# EAGLE design volume_ctrl (EAGLE 7.5.0)
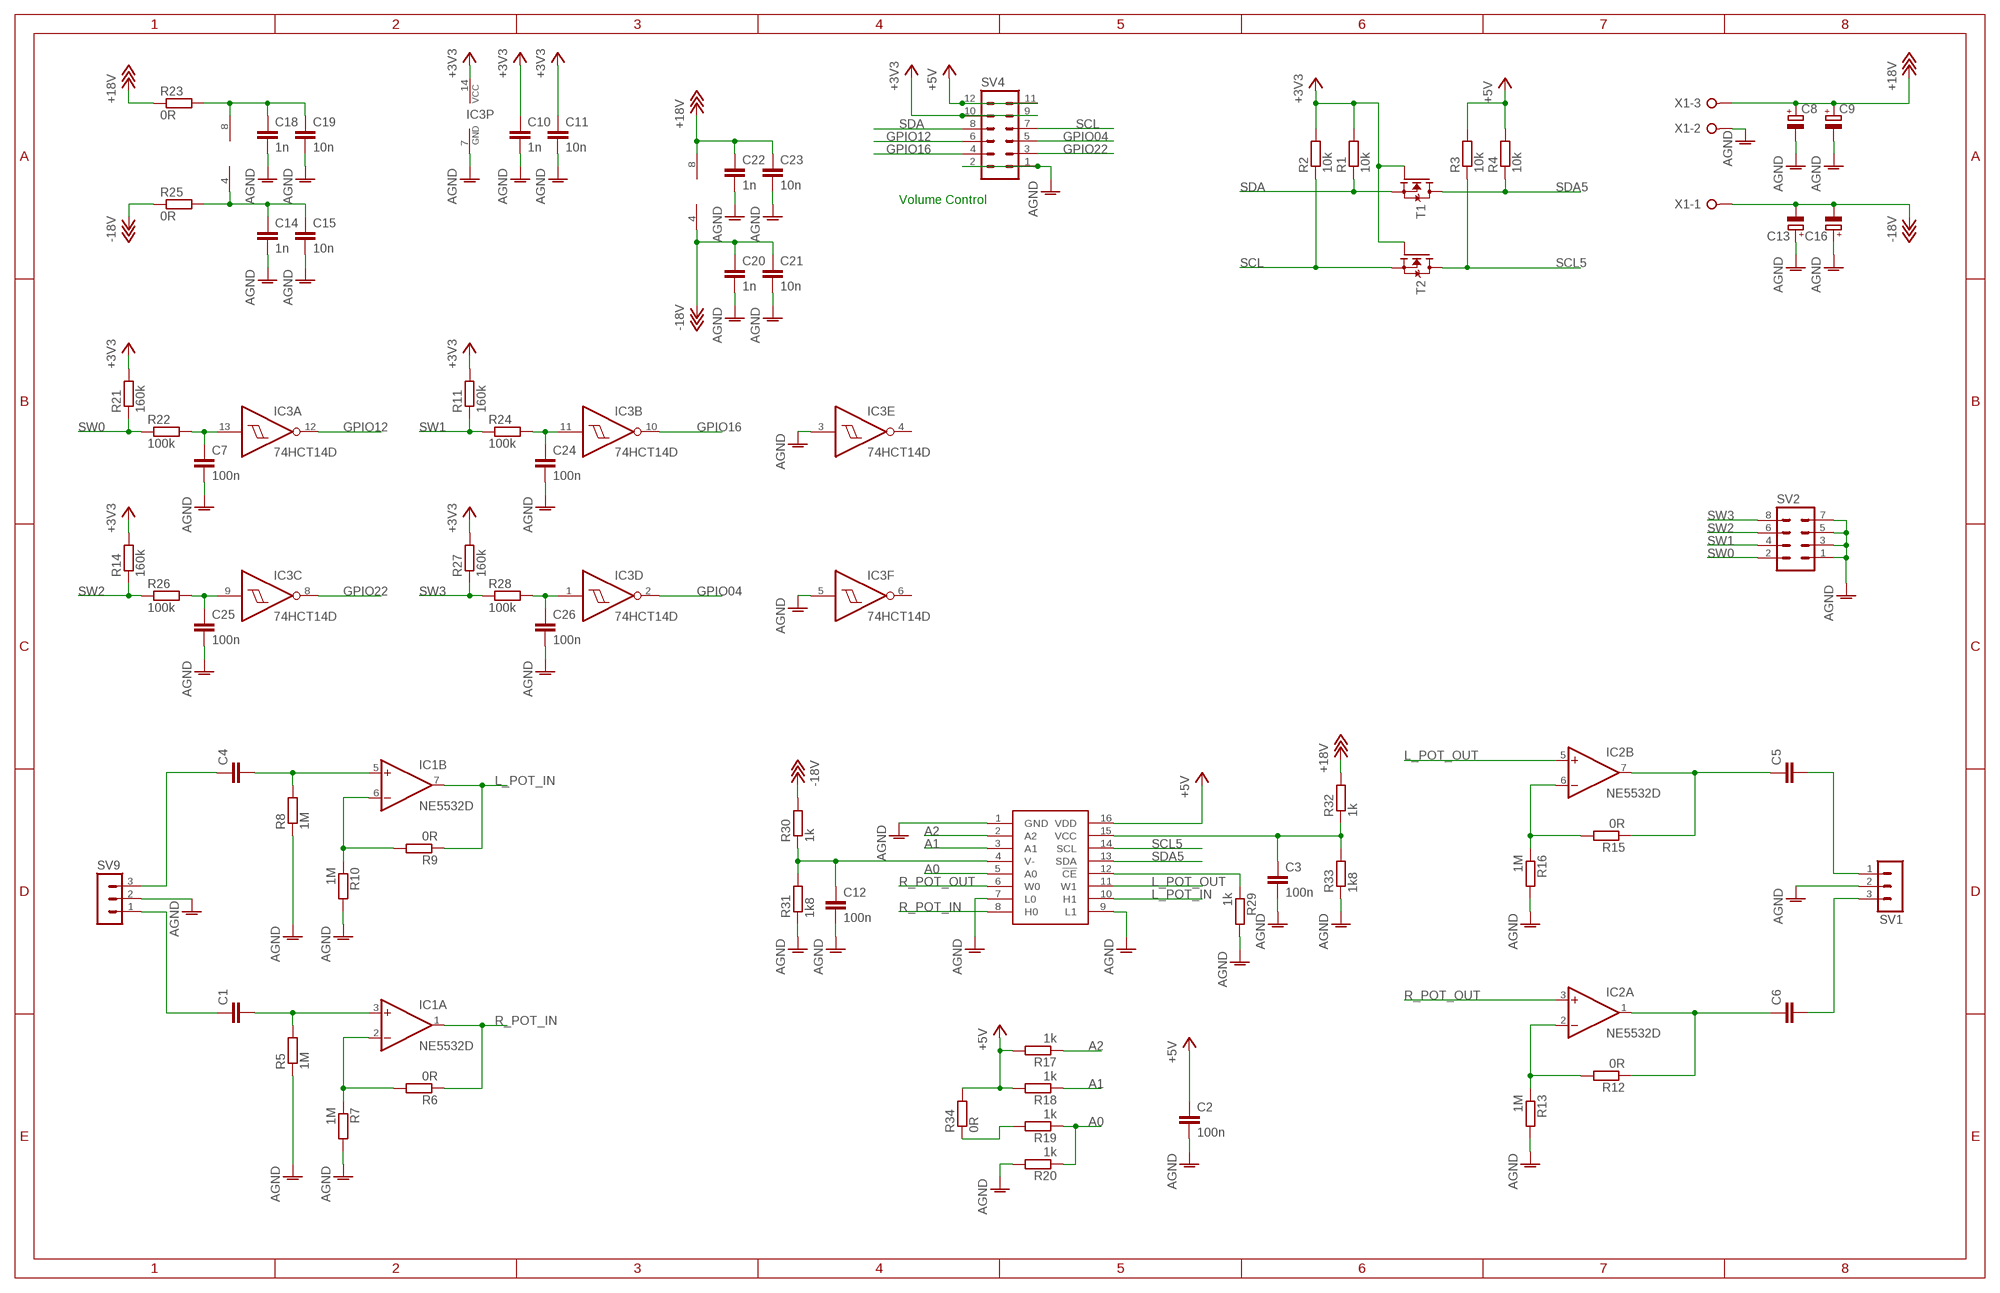
[diagram p0: schematic, sheet 1]

## Parts
C1  C22/7  [C22.5B7]
C2  100n  C-EUC0603  [C0603]
C3  100n  C-EUC0603  [C0603]
C4  C22/7  [C22.5B7]
C5  C22/7  [C22.5B7]
C6  C22/7  [C22.5B7]
C7  100n  C-EUC0603  [C0603]
C8  CPOL-EUE5-10.5  [E5-10,5]
C9  CPOL-EUE5-10.5  [E5-10,5]
C10  1n  C-EUC0603  [C0603]
C11  10n  C-EUC0603  [C0603]
C12  100n  C-EUC0603  [C0603]
C13  CPOL-EUE5-10.5  [E5-10,5]
C14  1n  C-EUC0603  [C0603]
C15  10n  C-EUC0603  [C0603]
C16  CPOL-EUE5-10.5  [E5-10,5]
C18  1n  C-EUC0603  [C0603]
C19  10n  C-EUC0603  [C0603]
C20  1n  C-EUC0603  [C0603]
C21  10n  C-EUC0603  [C0603]
C22  1n  C-EUC0603  [C0603]
C23  10n  C-EUC0603  [C0603]
C24  100n  C-EUC0603  [C0603]
C25  100n  C-EUC0603  [C0603]
C26  100n  C-EUC0603  [C0603]
IC1  NE5532D  [SO08]
IC2  NE5532D  [SO08]
IC3  74HCT14D  [SO14]
IC4  DS1882  [SO16]
R1  10k  R-EU_R0805  [R0805]
R2  10k  R-EU_R0805  [R0805]
R3  10k  R-EU_R0805  [R0805]
R4  10k  R-EU_R1206  [R1206]
R5  1M  R-EU_R0805  [R0805]
R6  0R  R-EU_R0805  [R0805]
R7  1M  R-EU_R0805  [R0805]
R8  1M  R-EU_R0805  [R0805]
R9  0R  R-EU_R0805  [R0805]
R10  1M  R-EU_R0805  [R0805]
R11  160k  R-EU_R1206  [R1206]
R12  0R  R-EU_R0805  [R0805]
R13  1M  R-EU_R0805  [R0805]
R14  160k  R-EU_R1206  [R1206]
R15  0R  R-EU_R0805  [R0805]
R16  1M  R-EU_R0805  [R0805]
R17  1k  R-EU_R0805  [R0805]
R18  1k  R-EU_R0805  [R0805]
R19  1k  R-EU_R0805  [R0805]
R20  1k  R-EU_R0805  [R0805]
R21  160k  R-EU_R0603  [R0603]
R22  100k  R-EU_R0603  [R0603]
R23  0R  R-EU_R1206  [R1206]
R24  100k  R-EU_R0603  [R0603]
R25  0R  R-EU_R1206  [R1206]
R26  100k  R-EU_R0603  [R0603]
R27  160k  R-EU_R0603  [R0603]
R28  100k  R-EU_R0603  [R0603]
R29  1k  R-EU_R0805  [R0805]
R30  1k  R-EU_R0805  [R0805]
R31  1k8  R-EU_R0805  [R0805]
R32  1k  R-EU_R0805  [R0805]
R33  1k8  R-EU_R0805  [R0805]
R34  0R  R-EU_R1206  [R1206]
SV1  MA03-1  [MA03-1]
SV2  MA04-2  [MA04-2]
SV4  MA06-2  [MA06-2]
SV9  MA03-1  [MA03-1]
T1  MOSFET-N-SOT23  [SOT23]
T2  MOSFET-N-SOT23  [SOT23]
X1  W237-3E  [W237-3E]

## Nets
+3V3: C10.1 C11.1 IC3.14(P:VCC) R1.2 R2.2 R11.2 R14.2 R21.2 R27.2 SV4.9 SV4.10 T1.1(G) T2.1(G)
+5V: C2.1 IC4.16(VDD) R3.2 R4.2 R17.2 R18.2 R34.2 SV4.11 SV4.12
+18V: C8.+ C9.+ C22.1 C23.1 IC2.8(P:V+) R23.1 R32.2 X1.3
-18V: C13.- C16.- C20.1 C21.1 IC2.4(P:V-) R25.1 R30.2 X1.1
A0: IC4.5(A0) R19.1 R20.1
A1: IC4.3(A1) R18.1
A2: IC4.2(A2) R17.1
AGND: C2.2 C3.2 C7.2 C8.- C9.- C10.2 C11.2 C12.2 C13.+ C14.2 C15.2 C16.+ C18.2 C19.2 C20.2 C21.2 C22.2 C23.2 C24.2 C25.2 C26.2 IC3.3(E:I) IC3.5(F:I) IC3.7(P:GND) IC4.1(GND) IC4.7(L0) IC4.9(L1) R5.1 R7.2 R8.1 R10.2 R13.2 R16.2 R20.2 R29.2 R31.1 R33.1 SV1.2 SV2.1 SV2.3 SV2.5 SV2.7 SV4.1 SV4.2 SV9.2 X1.2
GPIO04: IC3.2(D:O) SV4.5
GPIO12: IC3.12(A:O) SV4.6
GPIO16: IC3.10(B:O) SV4.4
GPIO22: IC3.8(C:O) SV4.3
L_POT_IN: IC1.7(B:OUT) IC4.10(H1) R9.1
L_POT_OUT: IC2.5(B:+IN) IC4.11(W1)
N$1: IC1.2(A:-IN) R6.2 R7.1
N$2: C1.2 IC1.3(A:+IN) R5.2
N$3: C4.1 SV9.3
N$4: IC1.6(B:-IN) R9.2 R10.1
N$5: C4.2 IC1.5(B:+IN) R8.2
N$6: C1.1 SV9.1
N$7: IC2.2(A:-IN) R12.2 R13.1
N$8: C5.2 SV1.1
N$9: IC2.6(B:-IN) R15.2 R16.1
N$10: C6.2 SV1.3
N$11: C5.1 IC2.7(B:OUT) R15.1
N$12: C6.1 IC2.1(A:OUT) R12.1
N$13: C7.1 IC3.13(A:I) R22.2
N$14: C24.1 IC3.11(B:I) R24.2
N$15: C25.1 IC3.9(C:I) R26.2
N$16: C26.1 IC3.1(D:I) R28.2
N$17: IC4.12(!CE) R29.1
N$18: C12.1 IC4.4(V-) R30.1 R31.2
N$19: C3.1 IC4.15(VCC) R32.1 R33.2
N$20: C18.1 C19.1 IC1.8(P:V+) R23.2
N$21: C14.1 C15.1 IC1.4(P:V-) R25.2
N$22: R19.2 R34.1
R_POT_IN: IC1.1(A:OUT) IC4.8(H0) R6.1
R_POT_OUT: IC2.3(A:+IN) IC4.6(W0)
SCL: R2.1 SV4.7 T2.2(S)
SCL5: IC4.14(SCL) R3.1 T2.3(D)
SDA: R1.1 SV4.8 T1.2(S)
SDA5: IC4.13(SDA) R4.1 T1.3(D)
SW0: R21.1 R22.1 SV2.2
SW1: R11.1 R24.1 SV2.4
SW2: R14.1 R26.1 SV2.6
SW3: R27.1 R28.1 SV2.8
Unconnected: IC3.4(E:O) IC3.6(F:O)

## Notes on the sheet
- Volume Control

## Library data of the parts
C1 C4-C6 = capacitor-wima:C: CAPACITOR naming: grid - package width
C2 C3 C7 C10-C12 C14 C15 C18-C26 = rcl:C-EU: CAPACITOR, European symbol
C8 C9 C13 C16 = rcl:CPOL-EU: POLARIZED CAPACITOR, European symbol
IC1 IC2 = linear:NE5532: AUDIO AMPLIFIER
IC3 = 74xx-eu:74*14: Hex schmitt trigger INVERTER
IC4 = ds1882:DS1882
R1-R3 R5-R10 R12 R13 R15-R20 R29-R33 = resistor:R-EU_: RESISTOR, European symbol
R4 R11 R14 R21-R28 R34 = rcl:R-EU_: RESISTOR, European symbol
SV1 SV9 = con-lstb:MA03-1: PIN HEADER; OC_FARNELL: unknown; OC_NEWARK: unknown
SV2 = con-lstb:MA04-2: PIN HEADER; OC_FARNELL: unknown; OC_NEWARK: unknown
SV4 = con-lstb:MA06-2: PIN HEADER; OC_FARNELL: unknown; OC_NEWARK: unknown
T1 T2 = we-transistor:MOSFET-N: N-Channel MOSFET (e.g. IRLML2502, BSS138)
X1 = con-wago-508:W237-3E: WAGO SREW CLAMP; OC_FARNELL: unknown; OC_NEWARK: unknown

## Board
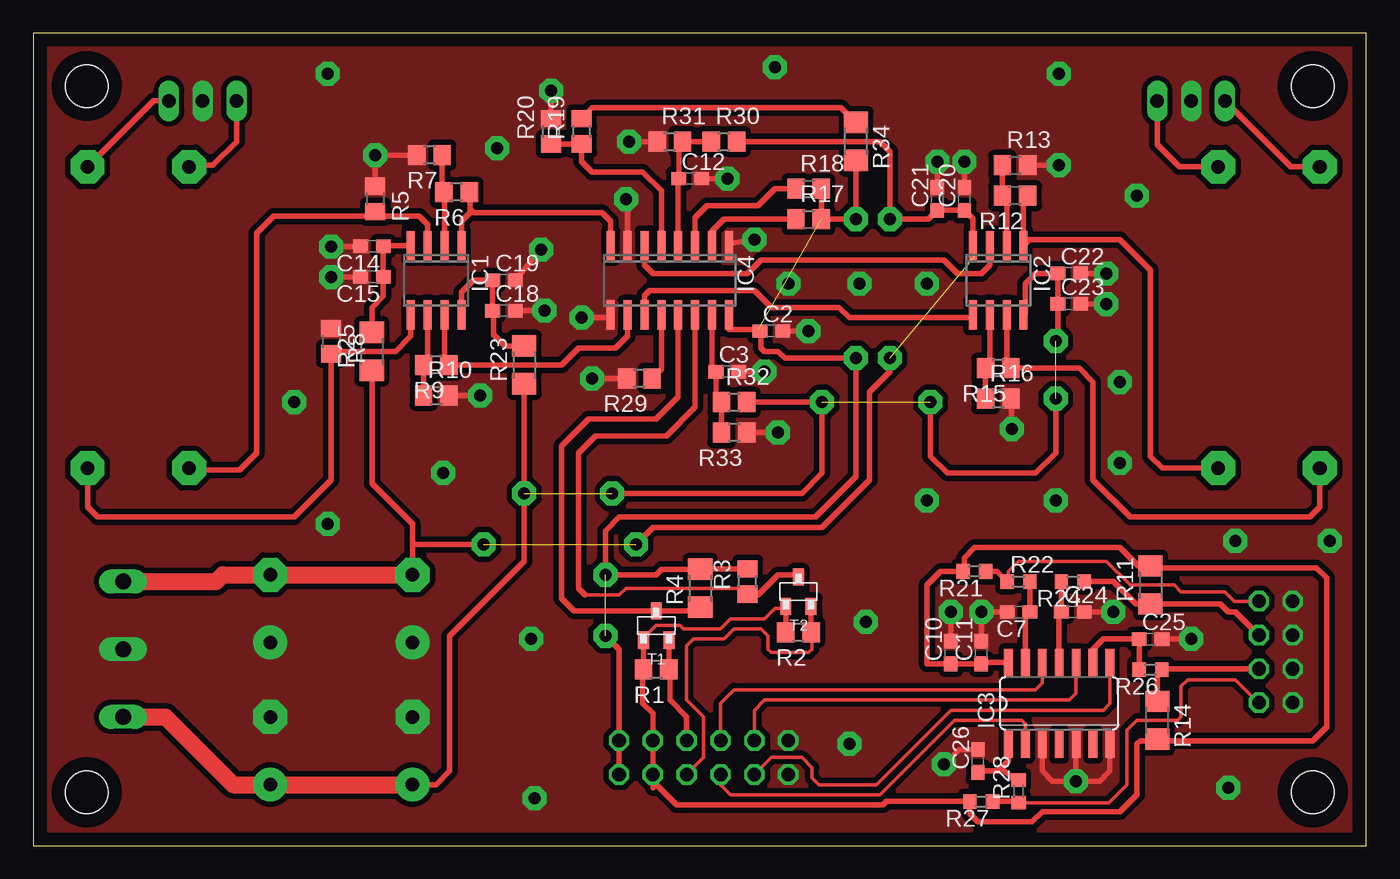
[diagram p1: board, top side]
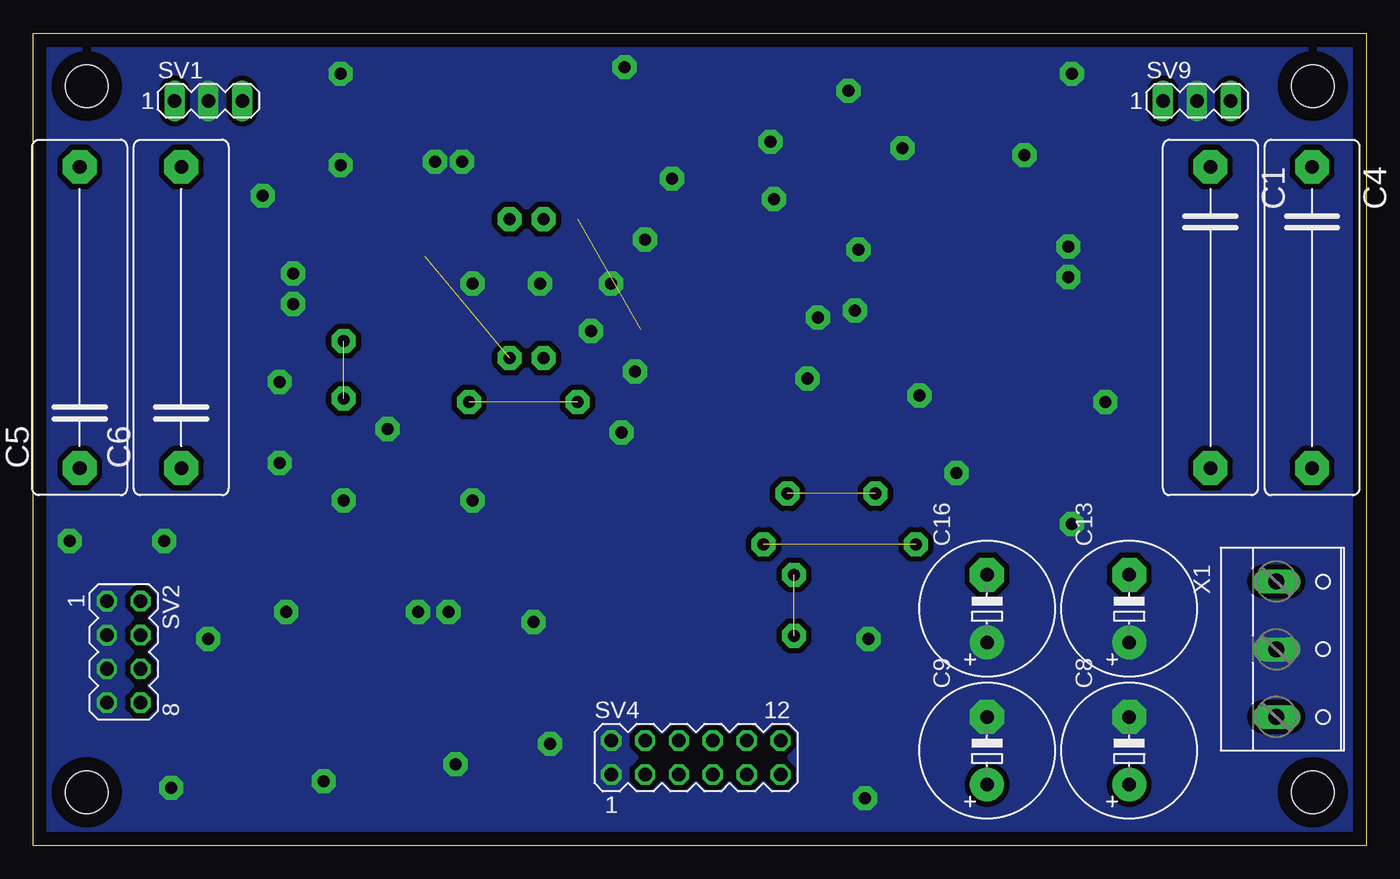
[diagram p2: board, bottom side, seen from below]

Size 100 x 60.95 mm. Coordinates in mm from the lower left corner, seen from the top.
Outline: 0,0 100,0 100,60.95 0,60.95 0,0
Copper layers (1*16): Top 0.035mm / dielectric 1.5mm / Bottom 0.035mm
Design rules "default": minimum track width 10mil, minimum drill 24mil, track to track 8mil, track to pad 8mil, pad to pad 8mil, via to via 8mil, smd to smd 8mil, copper to edge 40mil, drill to drill 8mil, minimum pad ring 10mil, minimum via ring 8mil, stop-mask expansion 4mil, vias tented up to drill 0mil, thermal gap 10mil
Holes 3.2 mm at 4,57 96,57 96,4 4,4

### Footprints (pad centres in the part's own frame; a part is rotated, then mirrored left to right if it is on the bottom)
C22.5B7 = drill 1.016 pad 2.54 octagon: 1 -11.303,0; 2 11.303,0
C0603 = smd 1.1 x 1: 1 -0.85,0; 2 0.85,0
E5-10,5 = drill 1.016 pad 2.54: + -2.54,0 | drill 1.016 pad 2.54 octagon: - 2.54,0
SO08 = smd 0.6 x 2.2: 1 -1.905,-2.6; 2 -0.635,-2.6; 3 0.635,-2.6; 4 1.905,-2.6; 5 1.905,2.6; 6 0.635,2.6; 7 -0.635,2.6; 8 -1.905,2.6
SO14 = smd 0.66 x 2.032: 1 -3.81,-3.073; 2 -2.54,-3.073; 3 -1.27,-3.073; 4 0,-3.073; 5 1.27,-3.073; 6 2.54,-3.073; 7 3.81,-3.073; 8 3.81,3.073; 9 2.54,3.073; 10 1.27,3.073; 11 0,3.073; 12 -1.27,3.073; 13 -2.54,3.073; 14 -3.81,3.073
SO16 = smd 0.6 x 2.2: 1 -4.445,-2.6; 2 -3.175,-2.6; 3 -1.905,-2.6; 4 -0.635,-2.6; 5 0.635,-2.6; 6 1.905,-2.6; 7 3.175,-2.6; 8 4.445,-2.6; 9 4.445,2.6; 10 3.175,2.6; 11 1.905,2.6; 12 0.635,2.6; 13 -0.635,2.6; 14 -1.905,2.6; 15 -3.175,2.6; 16 -4.445,2.6
R0805 = smd 1.3 x 1.5: 1 -0.95,0; 2 0.95,0
R1206 = smd 1.6 x 1.803: 1 -1.422,0; 2 1.422,0
R0603 = smd 1 x 1.1: 1 -0.85,0; 2 0.85,0
MA03-1 = drill 1.016 long: 1 -2.54,0; 2 0,0; 3 2.54,0
MA04-2 = drill 1.016 octagon: 1 -3.81,-1.27; 2 -3.81,1.27; 3 -1.27,-1.27; 4 -1.27,1.27; 5 1.27,-1.27; 6 1.27,1.27; 7 3.81,-1.27; 8 3.81,1.27
MA06-2 = drill 1.016 octagon: 1 -6.35,-1.27; 2 -6.35,1.27; 3 -3.81,-1.27; 4 -3.81,1.27; 5 -1.27,-1.27; 6 -1.27,1.27; 7 1.27,-1.27; 8 1.27,1.27; 9 3.81,-1.27; 10 3.81,1.27; 11 6.35,-1.27; 12 6.35,1.27
SOT23 = smd 1.3 x 0.9: 1 -1.1,0.95; 2 -1.1,-0.95; 3 1.1,0
W237-3E = drill 1.194 long: 1 -5.08,-0.635; 2 0,-0.635; 3 5.08,-0.635

### Placement (x,y rotation side)
C1  11.68,39.62 270 bottom
C2  55.37,38.61 0 top
C3  52.07,35.56 0 top
C4  4.06,39.62 270 bottom
C5  96.52,39.62 90 bottom
C6  88.9,39.62 90 bottom
C7  73.91,17.53 180 top
C8  17.78,7.11 90 bottom
C9  28.45,7.11 90 bottom
C10  68.83,14.48 90 top
C11  71.12,14.48 90 top
C12  49.28,50.04 0 top
C13  17.78,17.78 90 bottom
C14  25.4,44.96 180 top
C15  25.4,42.67 180 top
C16  28.45,17.78 90 bottom
C18  35.31,40.13 0 top
C19  35.31,42.42 0 top
C20  69.85,48.51 90 top
C21  67.82,48.51 90 top
C22  77.72,42.93 0 top
C23  77.72,40.64 0 top
C24  77.98,17.53 0 top
C25  83.82,15.49 0 top
C26  70.87,6.35 90 top
IC1  30.23,42.42 180 top
IC2  72.39,42.42 180 top
IC3  76.96,10.67 0 top
IC4  47.75,42.42 180 top
R1  46.74,13.21 180 top
R2  57.4,16 180 top
R3  53.59,19.81 90 top
R4  50.04,19.3 90 top
R5  25.65,48.51 270 top
R6  31.75,49.02 180 top
R7  29.72,51.82 180 top
R8  22.35,37.85 270 top
R9  30.23,36.07 180 top
R10  30.23,33.78 0 top
R11  83.82,19.56 90 top
R12  73.66,48.77 180 top
R13  73.66,51.05 0 top
R14  84.33,9.4 270 top
R15  72.39,35.81 180 top
R16  72.39,33.53 0 top
R17  58.17,46.99 0 top
R18  58.17,49.28 0 top
R19  41.15,53.59 90 top
R20  38.86,53.59 90 top
R21  70.61,20.57 180 top
R22  73.91,19.81 0 top
R23  36.83,36.07 90 top
R24  77.98,19.81 180 top
R25  25.4,37.08 90 top
R26  83.82,13.21 180 top
R27  71.12,3.3 180 top
R28  73.91,4.06 90 top
R29  45.47,35.05 180 top
R30  51.82,52.83 0 top
R31  47.75,52.83 0 top
R32  52.58,33.27 0 top
R33  52.58,30.99 180 top
R34  61.72,52.83 270 top
SV1  86.87,55.88 0 bottom
SV2  93.22,14.53 270 bottom
SV4  50.29,6.6 0 bottom
SV9  12.7,55.88 0 bottom
T1  46.74,16.51 90 top
T2  57.4,19.05 90 top
X1  6.1,14.73 270 bottom

### Tracks (layer width: path | path; a pad name or v marks a point on that pad's centre or on a via)
+3V3
  Top 0.25: T1.1 45.79,15.56 46.74,16.51
  Top 0.254: 46.74,16.51 48.51,16.51 48.77,16.26 51.56,16.26 52.32,17.02 54.86,17.02 55.63,17.78 56.28,17.78 T2.1
  Top 0.406: R14.2 84.33,7.87 | IC3.14 71.23,13.74 C11.1 C10.1 67.06,13.63 67.06,19.56 68.07,20.57 R21.2 69.85,20.66 69.85,21.59 70.61,22.35 81.53,22.35 82.91,20.98 R11.2 83.97,20.83 96.27,20.83 97.03,20.07 97.03,8.89 96.01,7.87 84.33,7.87 | T1.1 R1.2 45.72,13.14 45.72,10.67 46.48,9.91 SV4.10 SV4.9 46.48,4.83 | 46.48,4.83 46.48,4.32 | T2.1 R2.2 | 46.48,4.83 48.26,3.05 63.75,3.05 64.01,3.3 R27.2 70.27,2.37 70.87,1.78 74.93,1.78 75.69,2.54 81.53,2.54 82.8,3.81 82.8,7.62 83.06,7.87 84.33,7.87
+5V  (via drill 0.9 pad 1.8)  (2 unrouted)
  Top 0.406: SV4.11 SV4.12 43.94,14.73 v42.93,15.75 | R18.2 R17.2 v61.72,46.99 R34.2 | IC4.16 52.2,38.73 54.4,38.73 C2.1 54.61,38.52 54.61,37.34 54.86,37.08 55.88,37.08 56.39,36.58 v61.72,36.58 61.72,27.69 58.67,24.64 43.94,24.64 42.93,23.62 v42.93,20.32 46.74,20.32 47.14,20.73 R4.2 50.07,20.76 R3.2
+18V  (via drill 0.9 pad 1.8)  (3 unrouted)
  Top 0.406: R23.1 v36.83,26.42 36.83,21.34 31.24,15.75 31.24,5.59 30.23,4.57 C9.+ | IC2.8 74.42,39.95 74.42,42.16 75.18,42.93 C22.1 C23.1 76.87,38.01 v76.71,37.85 | v76.71,33.53 76.71,29.46 75.18,27.94 68.58,27.94 67.31,29.21 v67.31,33.27 | R32.2 v59.18,33.27 59.18,27.94 57.66,26.42 v43.43,26.42
  Top 1.27: X1.3 9.91,9.65 14.99,4.57 C8.+ C9.+
-18V  (via drill 0.9 pad 1.8)  (2 unrouted)
  Top 0.406: C21.1 C20.1 70.48,47.03 IC2.4 70.61,44.89 70.61,44.2 | 67.73,47.75 C21.1 | C21.1 67.14,46.99 v64.26,46.99 64.26,52.07 63.5,52.83 R30.2 | C16.- 28.45,22.61 | v33.78,22.61 28.45,22.61 | R25.1 25.4,27.18 28.45,24.13 28.45,22.61 | v64.26,36.58 64.26,35.56 62.74,34.04 62.74,27.43 59.18,23.88 46.48,23.88 v45.21,22.61
  Top 1.27: X1.1 13.72,19.81 14.22,20.32 C13.- C16.-
A0
  Top 0.406: R20.1 R19.1 41.15,51.31 41.91,50.55 45.72,50.55 47.12,49.15 IC4.5
A1
  Top 0.406: IC4.3 49.66,47.12 50.55,48.01 54.36,48.01 55.63,49.28 R18.1
A2
  Top 0.406: IC4.2 50.93,46.1 51.82,46.99 R17.1
AGND  (via drill 0.9 pad 1.8)
  Top 0.406: C14.2 v22.35,44.96 | C15.2 v22.35,42.67 | C18.2 v38.35,40.13 | C19.2 v38.1,44.7 | R5.1 v25.65,51.82 R7.2 | R20.2 v38.86,56.64 | C2.2 v58.17,38.61 | R33.1 v55.88,30.99 | R31.1 v44.7,52.83 | C22.2 v80.52,42.93 | C23.2 v80.52,40.64 | C21.2 v67.82,51.31 | C20.2 v69.85,51.31 | R16.2 v73.41,31.24 | R13.2 v76.96,51.05 | IC4.7 44.58,48.39 v44.45,48.51 | v54.1,45.47 52.39,45.21 IC4.1 | C12.2 v52.07,50.04 | R29.2 v41.91,35.05 | C3.2 v54.86,35.56 | v41.15,39.62 43.11,39.62 IC4.9 | R10.2 v33.53,33.78 | C11.2 v71.12,17.53 C7.2 | C10.2 v68.83,17.53 | C25.2 v86.87,15.49 | 75.69,7.62 IC3.3 75.69,5.59 76.45,4.83 v78.23,4.83 | 80.77,7.62 IC3.7 80.77,5.59 80.01,4.83 v78.23,4.83 | C24.2 v81.03,17.53 | IC3.5 v78.23,4.83 | C26.2 69.43,7.2 v68.33,6.1
  other vias: 56.64,42.16 22.1,57.91 55.63,58.42 76.96,57.91 82.8,48.77 76.71,25.91 90.17,22.86 97.28,22.86 67.06,25.91 62.48,16.76 89.66,4.32 61.21,7.62 37.59,3.56 37.34,15.49 30.73,27.94 34.8,52.32 67.06,42.16 61.98,42.16 22.1,24.13 19.56,33.27 81.53,34.8 81.53,28.7
  pour Bottom (isolate 0.406, no thermals): 0,60.96 100.33,60.96 100.33,0 0,0
  pour Top (isolate 0.406, no thermals): 0,0 100.33,0 100.33,60.96 0,60.96
GPIO04
  Top 0.25: IC3.2 74.42,9.14 74.17,9.4 69.09,9.4 63.5,3.81 52.32,3.81 51.56,4.57 SV4.5
GPIO12
  Top 0.25: 75.69,14.48 IC3.12 75.69,12.19 75.18,11.68 52.58,11.68 51.56,10.67 SV4.6
GPIO16
  Top 0.25: 78.23,14.48 IC3.10 78.23,11.43 77.72,10.92 54.86,10.92 54.1,10.16 SV4.4
GPIO22
  Top 0.25: IC3.8 80.77,10.67 80.26,10.16 68.83,10.16 65.15,6.48 | SV4.3 55.24,6.48
  Top 0.254: 65.15,6.48 63.25,4.57 58.93,4.57 58.42,5.08 58.42,5.84 57.66,6.6 55.37,6.6 55.24,6.48
L_POT_IN
  Top 0.406: R9.1 30.86,36.38 IC1.7 30.86,36.2 30.73,36.07 R9.1 | IC4.10 44.58,38.23 44.07,37.72 43.69,37.34 40.89,37.34 39.62,36.07 R9.1
L_POT_OUT
  Top 0.406: IC4.11 45.85,41.27 46.23,41.66 54.1,41.66 55.37,40.39 60.45,40.39 61.21,39.62 70.29,39.62 IC2.5 70.42,39.88
N$1
  Top 0.406: IC1.2 30.86,48.96 R6.2 30.67,49.15 R7.1
N$2
  Top 0.406: IC1.3 29.59,46.61 28.96,47.24 25.97,47.24 | 25.97,47.24 R5.2 | 25.97,47.24 18.03,47.24 16.76,45.97 16.76,29.46 15.49,28.19 11.81,28.19 C1.2
N$3
  Top 0.406: SV9.3 9.02,55.88 C4.1
N$4
  Top 0.406: R10.1 R9.2 29.59,36.38 IC1.6
N$5
  Top 0.406: IC1.5 28.32,38.23 27.18,37.08 22.29,37.08 R8.2 22.35,27.43 19.56,24.64 4.83,24.64 4.06,25.4 C4.2
N$6
  Top 0.406: SV9.1 15.24,52.83 13.46,51.05 11.81,51.05 C1.1
N$7
  Top 0.406: R13.1 R12.2 73.03,48.45 IC2.2
N$8
  Top 0.406: C5.2 94.36,50.93 SV1.1
N$9
  Top 0.406: IC2.6 71.75,36.13 R15.2 R16.1
N$10
  Top 0.406: C6.2 85.98,50.93 84.33,52.58 SV1.3
N$11
  Top 0.406: IC2.7 73.03,36.13 R15.1 78.49,35.81 79.5,34.8 79.5,27.43 82.3,24.64 83.82,24.64 84.33,24.64 95.76,24.64 96.52,25.4 C5.1
N$12
  Top 0.406: R12.1 74.3,48.45 IC2.1 74.74,45.47 81.53,45.47 83.82,43.18 83.82,29.21 84.71,28.32 C6.1
N$13
  Top 0.406: IC3.13 74.42,17.18 C7.1 R22.2
N$14
  Top 0.406: IC3.11 76.96,17.36 C24.1 R24.2
N$15
  Top 0.406: R26.2 C25.1 80.26,15.49 79.5,14.73 IC3.9
N$16
  Top 0.406: IC3.1 73.15,6.35 72.64,5.84 | 72.64,5.84 72.39,5.59 70.95,5.59 C26.1 | R28.2 73.57,4.91 72.64,5.84
N$17
  Top 0.406: IC4.12 47.12,35.75 R29.1
N$18
  Top 0.406: R30.1 R31.2 48.43,52.56 C12.1 48.39,50 IC4.4
N$19
  Top 0.406: R33.2 R32.1 51.22,33.68 C3.1 50.93,36.11 IC4.15
N$20
  Top 0.406: IC1.8 32.13,41.53 33.02,42.42 C19.1 C18.1 34.54,40.04 34.54,38.35 35.41,37.49 R23.2
N$21
  Top 0.406: IC1.4 26.31,45.02 C14.1 C15.1 26.25,41.24 25.4,40.39 R25.2
N$22
  Top 0.406: R19.2 41.15,54.61 41.91,55.37 60.6,55.37 R34.1
R_POT_IN
  Top 0.406: IC1.1 32.13,46.86 32.77,47.5 32.77,47.75 | 32.77,47.75 32.77,48.96 R6.1 | IC4.8 43.31,46.86 42.67,47.5 33.02,47.5 32.77,47.75
R_POT_OUT
  Top 0.406: IC4.6 45.85,43.56 46.48,42.93 53.59,42.93 54.61,43.94 68.33,43.94 69.34,42.93 71.12,42.93 71.75,43.56 IC2.3
SCL
  Top 0.254: SV4.7 50.29,6.6 50.29,9.65 49.02,10.92 49.02,14.99 49.53,15.49 51.82,15.49 52.58,16.26 54.61,16.26 55.12,15.75 55.12,14.73 55.37,14.48 58.17,14.48 58.42,14.73 58.42,15.94 R2.1
  Top 0.406: T2.2 R2.1
SCL5
  Top 0.25: 47.5,19.3 53.15,19.3 R3.1
  Top 0.254: 47.5,19.3 44.45,19.3 43.94,18.8 41.4,18.8
  Top 0.406: IC4.14 49.66,32.89 47.5,30.73 42.16,30.73 40.89,29.46 40.89,19.3 41.4,18.8 | R3.1 53.66,18.8 54.36,18.8 55.88,20.32 57.23,20.32 T2.3
SDA
  Top 0.406: T1.2 R1.1 47.75,13.14 47.75,10.92 49.02,9.65 SV4.8
SDA5
  Top 0.406: IC4.13 48.39,33.66 46.74,32 41.66,32 39.62,29.97 39.62,18.54 40.56,17.61 T1.3 49.77,17.61 R4.1 49.94,17.78
SW0
  Top 0.25: SV2.2 90.12,18.34 89.41,19.05 86.11,19.05 85.6,19.56 82.3,19.56 80.52,21.34 73.91,21.34 73.15,20.57 73.15,19.9 R22.1
  Top 0.406: R21.1 72.3,20.57 R22.1
SW1
  Top 0.406: R24.1 81.03,19.81 82.7,18.14 R11.1 89.05,18.14 89.66,17.53 90.17,17.53 91.9,15.8 SV2.4
SW2
  Top 0.406: R14.1 84.33,12.87 R26.1 84.72,13.26 SV2.6
SW3
  Top 0.25: R28.1 80.68,3.21 82.04,4.57 82.04,8.64 82.8,9.4 85.85,9.4
  Top 0.254: SV2.8 91.9,10.72 90.17,12.45 86.61,12.45 86.11,11.94 86.11,9.65 85.85,9.4
  Top 0.406: R27.1 73.83,3.3 R28.1